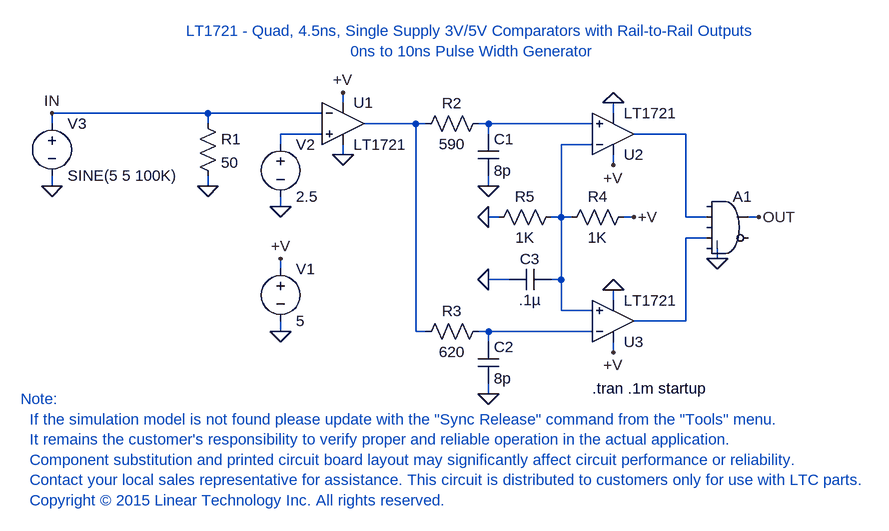
[diagram p0: schematic LT1721_AN98F19.asc]
LT1721_AN98F19.asc, the LTspice schematic file:
Version 4
SHEET 1 1424 708
WIRE 192 80 192 64
WIRE -16 96 -256 96
WIRE 160 96 -16 96
WIRE 608 96 608 80
WIRE -256 112 -256 96
WIRE -16 112 -16 96
WIRE 304 112 224 112
WIRE 320 112 304 112
WIRE 416 112 400 112
WIRE 576 112 416 112
WIRE 160 128 96 128
WIRE 416 128 416 112
WIRE 720 128 640 128
WIRE 96 144 96 128
WIRE 576 144 528 144
WIRE 192 160 192 144
WIRE 608 176 608 160
WIRE -256 208 -256 192
WIRE -16 208 -16 192
WIRE 416 208 416 192
WIRE 96 240 96 224
WIRE 432 256 416 256
WIRE 528 256 528 144
WIRE 528 256 512 256
WIRE 544 256 528 256
WIRE 640 256 624 256
WIRE 720 256 720 128
WIRE 752 256 720 256
WIRE 832 256 816 256
WIRE 752 288 720 288
WIRE 768 320 768 304
WIRE 96 336 96 320
WIRE 448 352 416 352
WIRE 528 352 528 256
WIRE 528 352 512 352
WIRE 608 384 608 368
WIRE 528 400 528 352
WIRE 576 400 528 400
WIRE 720 416 720 288
WIRE 720 416 640 416
WIRE 96 432 96 416
WIRE 304 432 304 112
WIRE 320 432 304 432
WIRE 416 432 400 432
WIRE 576 432 416 432
WIRE 416 448 416 432
WIRE 608 464 608 448
WIRE 416 528 416 512
FLAG 96 432 0
FLAG 96 320 +V
FLAG 768 320 0
FLAG 608 368 0
FLAG 608 80 0
FLAG 608 176 +V
FLAG 608 464 +V
FLAG 96 240 0
FLAG -16 208 0
FLAG 416 208 0
FLAG 416 256 0
FLAG 640 256 +V
FLAG 416 352 0
FLAG 416 528 0
FLAG -256 96 IN
FLAG 832 256 OUT
FLAG 192 64 +V
FLAG 192 160 0
FLAG -256 208 0
SYMBOL LT1721 192 48 R0
SYMATTR InstName U1
SYMBOL LT1721 608 192 M180
SYMATTR InstName U2
SYMBOL LT1721 608 480 M180
SYMATTR InstName U3
SYMBOL and 784 208 R0
SYMATTR InstName A1
SYMBOL voltage 96 320 R0
WINDOW 123 0 0 Left 2
WINDOW 39 0 0 Left 2
SYMATTR InstName V1
SYMATTR Value 5
SYMBOL voltage 96 128 R0
WINDOW 123 0 0 Left 2
WINDOW 39 0 0 Left 2
SYMATTR InstName V2
SYMATTR Value 2.5
SYMBOL res -32 96 R0
SYMATTR InstName R1
SYMATTR Value 50
SYMBOL res 416 96 R90
WINDOW 0 0 56 VBottom 2
WINDOW 3 32 56 VTop 2
SYMATTR InstName R2
SYMATTR Value 590
SYMBOL res 416 416 R90
WINDOW 0 0 56 VBottom 2
WINDOW 3 32 56 VTop 2
SYMATTR InstName R3
SYMATTR Value 620
SYMBOL res 640 240 R90
WINDOW 0 0 56 VBottom 2
WINDOW 3 32 56 VTop 2
SYMATTR InstName R4
SYMATTR Value 1K
SYMBOL res 528 240 R90
WINDOW 0 0 56 VBottom 2
WINDOW 3 32 56 VTop 2
SYMATTR InstName R5
SYMATTR Value 1K
SYMBOL cap 400 128 R0
SYMATTR InstName C1
SYMATTR Value 8p
SYMBOL cap 400 448 R0
SYMATTR InstName C2
SYMATTR Value 8p
SYMBOL cap 512 336 R90
WINDOW 0 0 32 VBottom 2
WINDOW 3 32 32 VTop 2
SYMATTR InstName C3
SYMATTR Value .1µ
SYMBOL voltage -256 96 R0
WINDOW 123 0 0 Left 2
WINDOW 39 0 0 Left 2
SYMATTR InstName V3
SYMATTR Value SINE(5 5 100K)
TEXT 576 520 Left 2 !.tran .1m startup
TEXT 392 16 Bottom 2 ;LT1721 - Quad, 4.5ns, Single Supply 3V/5V Comparators with Rail-to-Rail Outputs\n0ns to 10ns Pulse Width Generator
TEXT -304 536 Left 2 ;Note:\n  If the simulation model is not found please update with the "Sync Release" command from the "Tools" menu.\n  It remains the customer's responsibility to verify proper and reliable operation in the actual application.\n  Component substitution and printed circuit board layout may significantly affect circuit performance or reliability.\n  Contact your local sales representative for assistance. This circuit is distributed to customers only for use with LTC parts.\n  Copyright © 2015 Linear Technology Inc. All rights reserved.

The netlist it stands for:
* LT1721_AN98F19.asc
XU1 N003 IN +V 0 N001 LT1720  ; LT1721, pins In+ In- V+ V- OUT
XU2 N002 N005 +V 0 N004 LT1720  ; LT1721, pins In+ In- V+ V- OUT
XU3 N005 N007 +V 0 N006 LT1720  ; LT1721, pins In+ In- V+ V- OUT
A1 0 N004 0 N006 0 0 OUT 0 AND
V1 +V 0 5
V2 N003 0 2.5
R1 IN 0 50
R2 N002 N001 590
R3 N007 N001 620
R4 +V N005 1K
R5 N005 0 1K
C1 N002 0 8p
C2 N007 0 8p
C3 N005 0 .1µ
V3 IN 0 SINE(5 5 100K)
.tran .1m startup
* LT1721 - Quad, 4.5ns, Single Supply 3V/5V Comparators with Rail-to-Rail Outputs
* 0ns to 10ns Pulse Width Generator
* Note:
*   If the simulation model is not found please update with the "Sync Release" command from the "Tools" menu.
*   It remains the customer's responsibility to verify proper and reliable operation in the actual application.
*   Component substitution and printed circuit board layout may significantly affect circuit performance or reliability.
*   Contact your local sales representative for assistance. This circuit is distributed to customers only for use with LTC parts.
*   Copyright © 2015 Linear Technology Inc. All rights reserved.
.lib LTC.lib
.backanno
.end